# Altium schematic sheet CODEC.SchDoc
size A3; CheckedBy: José Ogando; Engineer: Eduardo Teofilo; Revision: A2; SheetNumber: 6; SheetTotal: 8
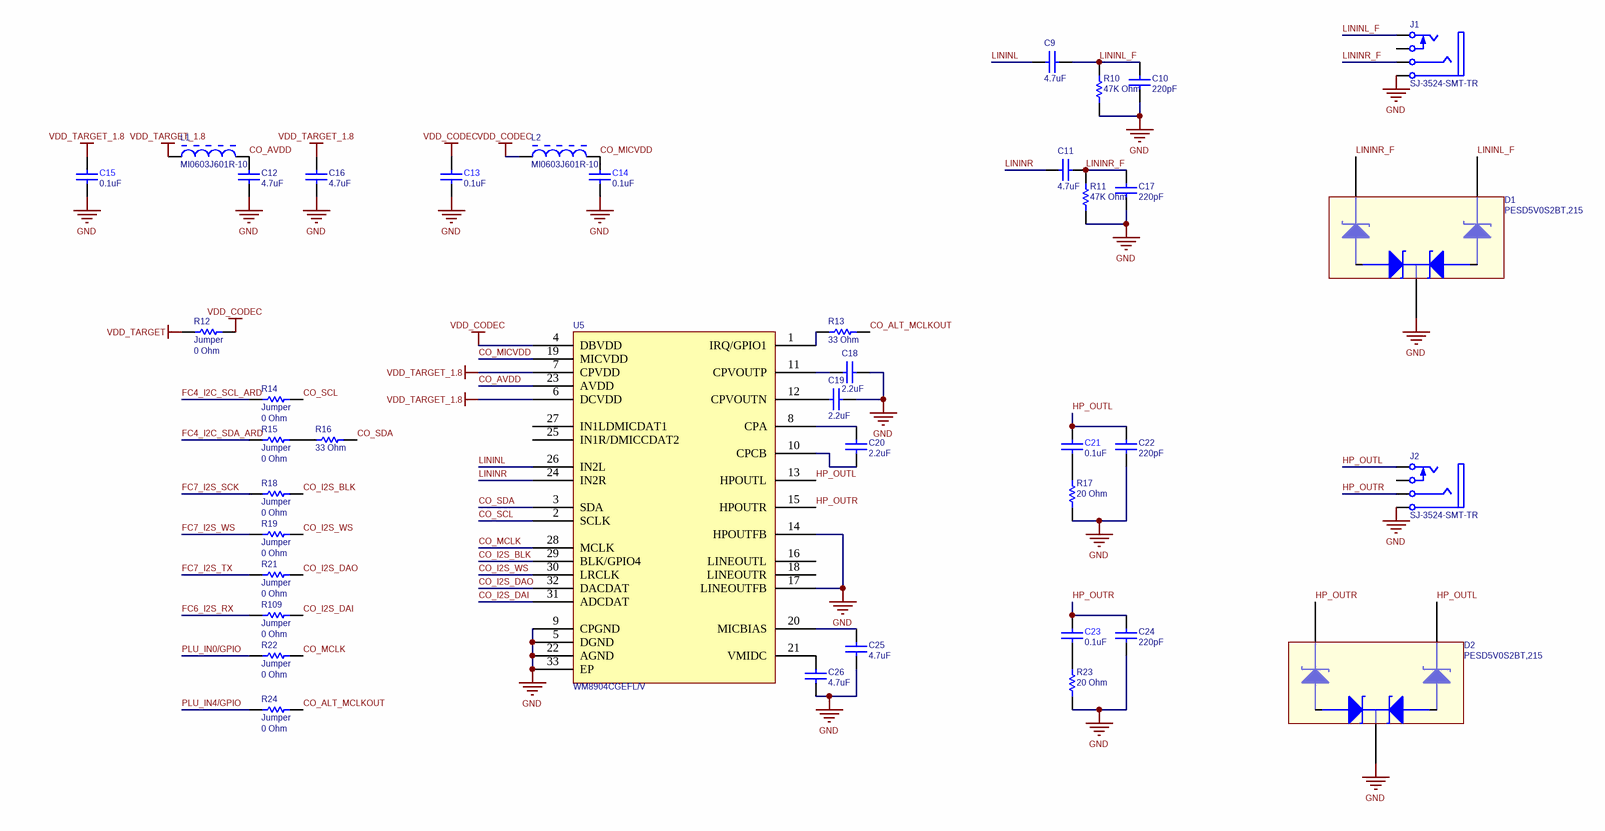
[diagram p0: CODEC.SchDoc]

## Parts
C9  value 4.7uF  [CAPC0603(1608)100_L]  (hidden comment: CAP 4.7uF 10V 0603(1608))
C10  value 220pF  [CAPC0402(1005)60_L]  (hidden comment: CAP 220pF 50V 0402(1005))
C11  value 4.7uF  [CAPC0603(1608)100_L]  (hidden comment: CAP 4.7uF 10V 0603(1608))
C12  value 4.7uF  [CAPC0603(1608)100_L]  (hidden comment: CAP 4.7uF 10V 0603(1608))
C13  value 0.1uF  [CAPC1005]  (hidden comment: CC0402KRX7R7BB104)
C14  value 0.1uF  [CAPC1005]  (hidden comment: CC0402KRX7R7BB104)
C15  value 0.1uF  [CAPC1005]  (hidden comment: CC0402KRX7R7BB104)
C16  value 4.7uF  [CAPC0603(1608)100_L]  (hidden comment: CAP 4.7uF 10V 0603(1608))
C17  value 220pF  [CAPC0402(1005)60_L]  (hidden comment: CAP 220pF 50V 0402(1005))
C18  value 2.2uF  [CAPC0402(1005)60_L]  (hidden comment: CAP 2.2uF 10V 0402(1005))
C19  value 2.2uF  [CAPC0402(1005)60_L]  (hidden comment: CAP 2.2uF 10V 0402(1005))
C20  value 2.2uF  [CAPC0402(1005)60_L]  (hidden comment: CAP 2.2uF 10V 0402(1005))
C21  value 0.1uF  [CAPC1005]  (hidden comment: CC0402KRX7R7BB104)
C22  value 220pF  [CAPC0402(1005)60_L]  (hidden comment: CAP 220pF 50V 0402(1005))
C23  value 0.1uF  [CAPC1005]  (hidden comment: CC0402KRX7R7BB104)
C24  value 220pF  [CAPC0402(1005)60_L]  (hidden comment: CAP 220pF 50V 0402(1005))
C25  value 4.7uF  [CAPC0603(1608)100_L]  (hidden comment: CAP 4.7uF 10V 0603(1608))
C26  value 4.7uF  [CAPC0603(1608)100_L]  (hidden comment: CAP 4.7uF 10V 0603(1608))
D1  PESD5V0S2BT,215  [SOT23-3]
D2  PESD5V0S2BT,215  [SOT23-3]
J1  SJ-3524-SMT-TR  [SJ-3524-SMT-TR]
J2  SJ-3524-SMT-TR  [SJ-3524-SMT-TR]
L1  MI0603J601R-10  [LIRD-MI0603J601R-10_V]
L2  MI0603J601R-10  [LIRD-MI0603J601R-10_V]
R10  value 47K Ohm  [RESC0402(1005)_L]  (hidden comment: 47K 1% 0402(1005))
R11  value 47K Ohm  [RESC0402(1005)_L]  (hidden comment: 47K 1% 0402(1005))
R12  Jumper  value 0 Ohm  [RESC0402(1005)_L]
R13  value 33 Ohm  [RESC0402(1005)_L]  (hidden comment: 33R 1% 0402(1005))
R14  Jumper  value 0 Ohm  [RESC0402(1005)_L]
R15  Jumper  value 0 Ohm  [RESC0402(1005)_L]
R16  value 33 Ohm  [RESC0402(1005)_L]  (hidden comment: 33R 1% 0402(1005))
R17  value 20 Ohm  [RESC0402(1005)_L]  (hidden comment: 20R 1% 0402(1005))
R18  Jumper  value 0 Ohm  [RESC0402(1005)_L]
R19  Jumper  value 0 Ohm  [RESC0402(1005)_L]
R21  Jumper  value 0 Ohm  [RESC0402(1005)_L]
R22  Jumper  value 0 Ohm  [RESC0402(1005)_L]
R23  value 20 Ohm  [RESC0402(1005)_L]  (hidden comment: 20R 1% 0402(1005))
R24  Jumper  value 0 Ohm  [RESC0402(1005)_L]
R109  Jumper  value 0 Ohm  [RESC0402(1005)_L]
U5  WM8904CGEFL/V  [QFN-32 4x4x0.75]

## Nets
GND: C10.1 C12.1 C13.2 C14.2 C15.2 C16.1 C17.1 C18.1 C19.1 C22.1 C24.1 C25.1 C26.1 D1.3(DK) D2.3(DK) J1.1(Sleeve) J2.1(Sleeve) R10.1 R11.1 R17.1 R23.1 U5.5(DGND) U5.9(CPGND) U5.14(HPOUTFB) U5.17(LINEOUTFB) U5.22(AGND) U5.33(EP)
VDD_CODEC: C13.1 L2.1 R12.1 U5.4(DBVDD)
VDD_TARGET: R12.2
VDD_TARGET_1.8: C15.1 C16.2 L1.1 U5.6(DCVDD) U5.7(CPVDD)
CO_ALT_MCLKOUT: R13.2 R24.1
CO_AVDD: C12.2 L1.2 U5.23(AVDD)
CO_I2S_BLK: R18.1 U5.29(BLK/GPIO4)
CO_I2S_DAI: R109.1 U5.31(ADCDAT)
CO_I2S_DAO: R21.1 U5.32(DACDAT)
CO_I2S_WS: R19.1 U5.30(LRCLK)
CO_MCLK: R22.1 U5.28(MCLK)
CO_MICVDD: C14.1 L2.2 U5.19(MICVDD)
CO_SCL: R14.1 U5.2(SCLK)
CO_SDA: R16.2 U5.3(SDA)
FC4_I2C_SCL_ARD: R14.2
FC4_I2C_SDA_ARD: R15.2
FC6_I2S_RX: R109.2
FC7_I2S_SCK: R18.2
FC7_I2S_TX: R21.2
FC7_I2S_WS: R19.2
HP_OUTL: C21.1 C22.2 D2.1(K1) J2.2(Tip) U5.13(HPOUTL)
HP_OUTR: C23.1 C24.2 D2.2(K2) J2.3(Ring) U5.15(HPOUTR)
LININL: C9.2 U5.26(IN2L)
LININL_F: C9.1 C10.2 D1.1(K1) J1.2(Tip) R10.2
LININR: C11.2 U5.24(IN2R)
LININR_F: C11.1 C17.2 D1.2(K2) J1.3(Ring) R11.2
PLU_IN0/GPIO: R22.2
PLU_IN4/GPIO: R24.2
NetC18_2: C18.2 U5.11(CPVOUTP)
NetC19_2: C19.2 U5.12(CPVOUTN)
NetC20_1: C20.1 U5.10(CPCB)
NetC20_2: C20.2 U5.8(CPA)
NetC21_2: C21.2 R17.2
NetC23_2: C23.2 R23.2
NetC25_2: C25.2 U5.20(MICBIAS)
NetC26_2: C26.2 U5.21(VMIDC)
NetR13_1: R13.1 U5.1(IRQ/GPIO1)
NetR15_1: R15.1 R16.1

Not connected (* = marked no-connect by the designer): J1 0 4(Tip_Switch); J2 0 4(Tip_Switch); U5 16(LINEOUTL) 18(LINEOUTR) 25(IN1R/DMICCDAT2) 27(IN1LDMICDAT1)

## Notes on the sheet
- Project:
- Sheet:
- Revision:
- Date:
- Size:
- Sheet number:
- Engineer
- Checked by:
- A3
- of
- www.code-ing.com

## Library data of the parts
C9 C11 C12 C16 C25 C26 = CMP-1035-02785-1: CAP 4.7uF 10V ±10% 0603 (1608 Metric) Thickness 1mm SMD; Tolerance: Â±10%; Case-EIA: 0603; Case-Metric: 1608; Max Thickness: 1 mm; Technology: SMT; Rated Voltage: 10 V
C10 C17 C22 C24 = CMP-1034-01367-1: CAP 220pF 50V ±1% 0402 (1005 Metric) Thickness 0.6mm SMD; Tolerance: Â±1%; Case-EIA: 0402; Case-Metric: 1005; Max Thickness: 0.6 mm; Technology: SMT; Rated Voltage: 50 V
C13-C15 C21 C23 = CMP-0001-00074-1: Capacitor, Yageo, Ceramic, 0.1uF 10% 16V 0402 (1005) X7R; Polarity: Non-Polarized; ClassName: Board Template Device; Rated Voltage: 16 V; Status: Production; Tolerance: 10 %; Mounting Technology: Surface Mount; Technology: Ceramic; Category: Capacitor; Dielectric: X7R; Publisher: Altium
C18-C20 = CMP-1034-02127-1: CAP 2.2uF 10V ±10% 0402 (1005 Metric) Thickness 0.6mm SMD; Case-EIA: 0402; Tolerance: Â±10%; Case-Metric: 1005; Technology: SMT; Rated Voltage: 10 V; Max Thickness: 0.6 mm
D1 D2 = PESD5V0S2BT,215: TVS DIODE 5V 14V SOT23; Manufacturer: Nexperia USA Inc.; Manufacturer part #: PESD5V0S2BT,215; Indications: *; Created by: eteofilo; Creation date: 17-Apr-2018; Value: *; Modified by: *
J1 J2 = SJ-3524-SMT-TR: CONN AUDIO JACK 3.5MM STEREO SMD; Manufacturer: CUI Inc; Manufacturer part#: SJ-3524-SMT-TR; Indications: *; Created by: gmoreno; Creation date: 23-May-2013; Modified by: *; Value: *
L1 L2 = CMP-2000-06700-1: Ferrite Bead, 600 Ohm, 1 A, -40 to 125 degC, 2-Pin SMD, RoHS, Tape and Reel; Manufacturer: Laird; DC Resistance (DCR) (Max): 200mOhm; Online Catalog: MISeries; Number of Lines: 1; Kits: 240-2227-ND-KITEMIFERRITEBEADCHIPSMD; Other Names: 240-2371-1; Impedance @ Frequency: 600Ohm@100MHz; Filter Type: PowerLine; Current Rating (Max): 1A; Catalog Drawings: (HI,HZ,LI,MI)0603Series_0.95mmMax.Height; Datasheet Version: Rev. C, 08/2013; Ratings: -; Package Description: 2-Pin Surface Mount Device, Body 1.6 x 0.8 mm; Operating Temperature: -40°C~125°C; Category: Filters; Mounting Type: SurfaceMount; Size / Dimension: 0.063"Lx0.031"W(1.60mmx0.80mm); Family: FerriteBeadsandChips; Package Reference: MI00603J601R-10; Manufacturer URL: https://www.lairdtech.com/; Height (Max): 0.037"(0.95mm); Series: MI; Packaging: CutTape(CT); Mounting Technology: SurfaceMount; Package / Case: 0603(1608Metric); Standard Package: 1; Datasheet URL: http://cdn.lairdtech.com/home/brandworld/files/MI0603J601R-10.pdf
R10 R11 = CMP-1011-00699-1: 47K 0.063W 1% 0402 (1005 Metric)  SMD; Case-EIA: 0402; Case-Metric: 1005; Power: 0.063 W; Technology: SMT; Tolerance: 1 %
R12 R14 R15 R18 R19 R21 R22 R24 R109 = CMP-1011-00001-1: Jumper 0402 (1005 Metric); Tolerance: None; Case-Metric: 1005; Case-EIA: 0402; Power: None; Technology: SMT
R13 R16 = CMP-1011-00341-1: 33R 0.063W 1% 0402 (1005 Metric)  SMD; Case-Metric: 1005; Case-EIA: 0402; Tolerance: 1 %; Power: 0.063 W; Technology: SMT
R17 R23 = CMP-1011-00316-1: 20R 0.063W 1% 0402 (1005 Metric)  SMD; Case-EIA: 0402; Case-Metric: 1005; Power: 0.063 W; Tolerance: 1 %; Technology: SMT
U5 = WM8904CGEFL/V: IC CODEC STEREO ULP 32QFN; Manufacturer: Cirrus Logic Inc.; Manufacturer part #: WM8904CGEFL/V; Indications: *; Created by: eteofilo; Creation date: 17-Apr-2018; Modified by: *; Value: *